# Altium schematic sheet CSI_connectors.SchDoc
size B
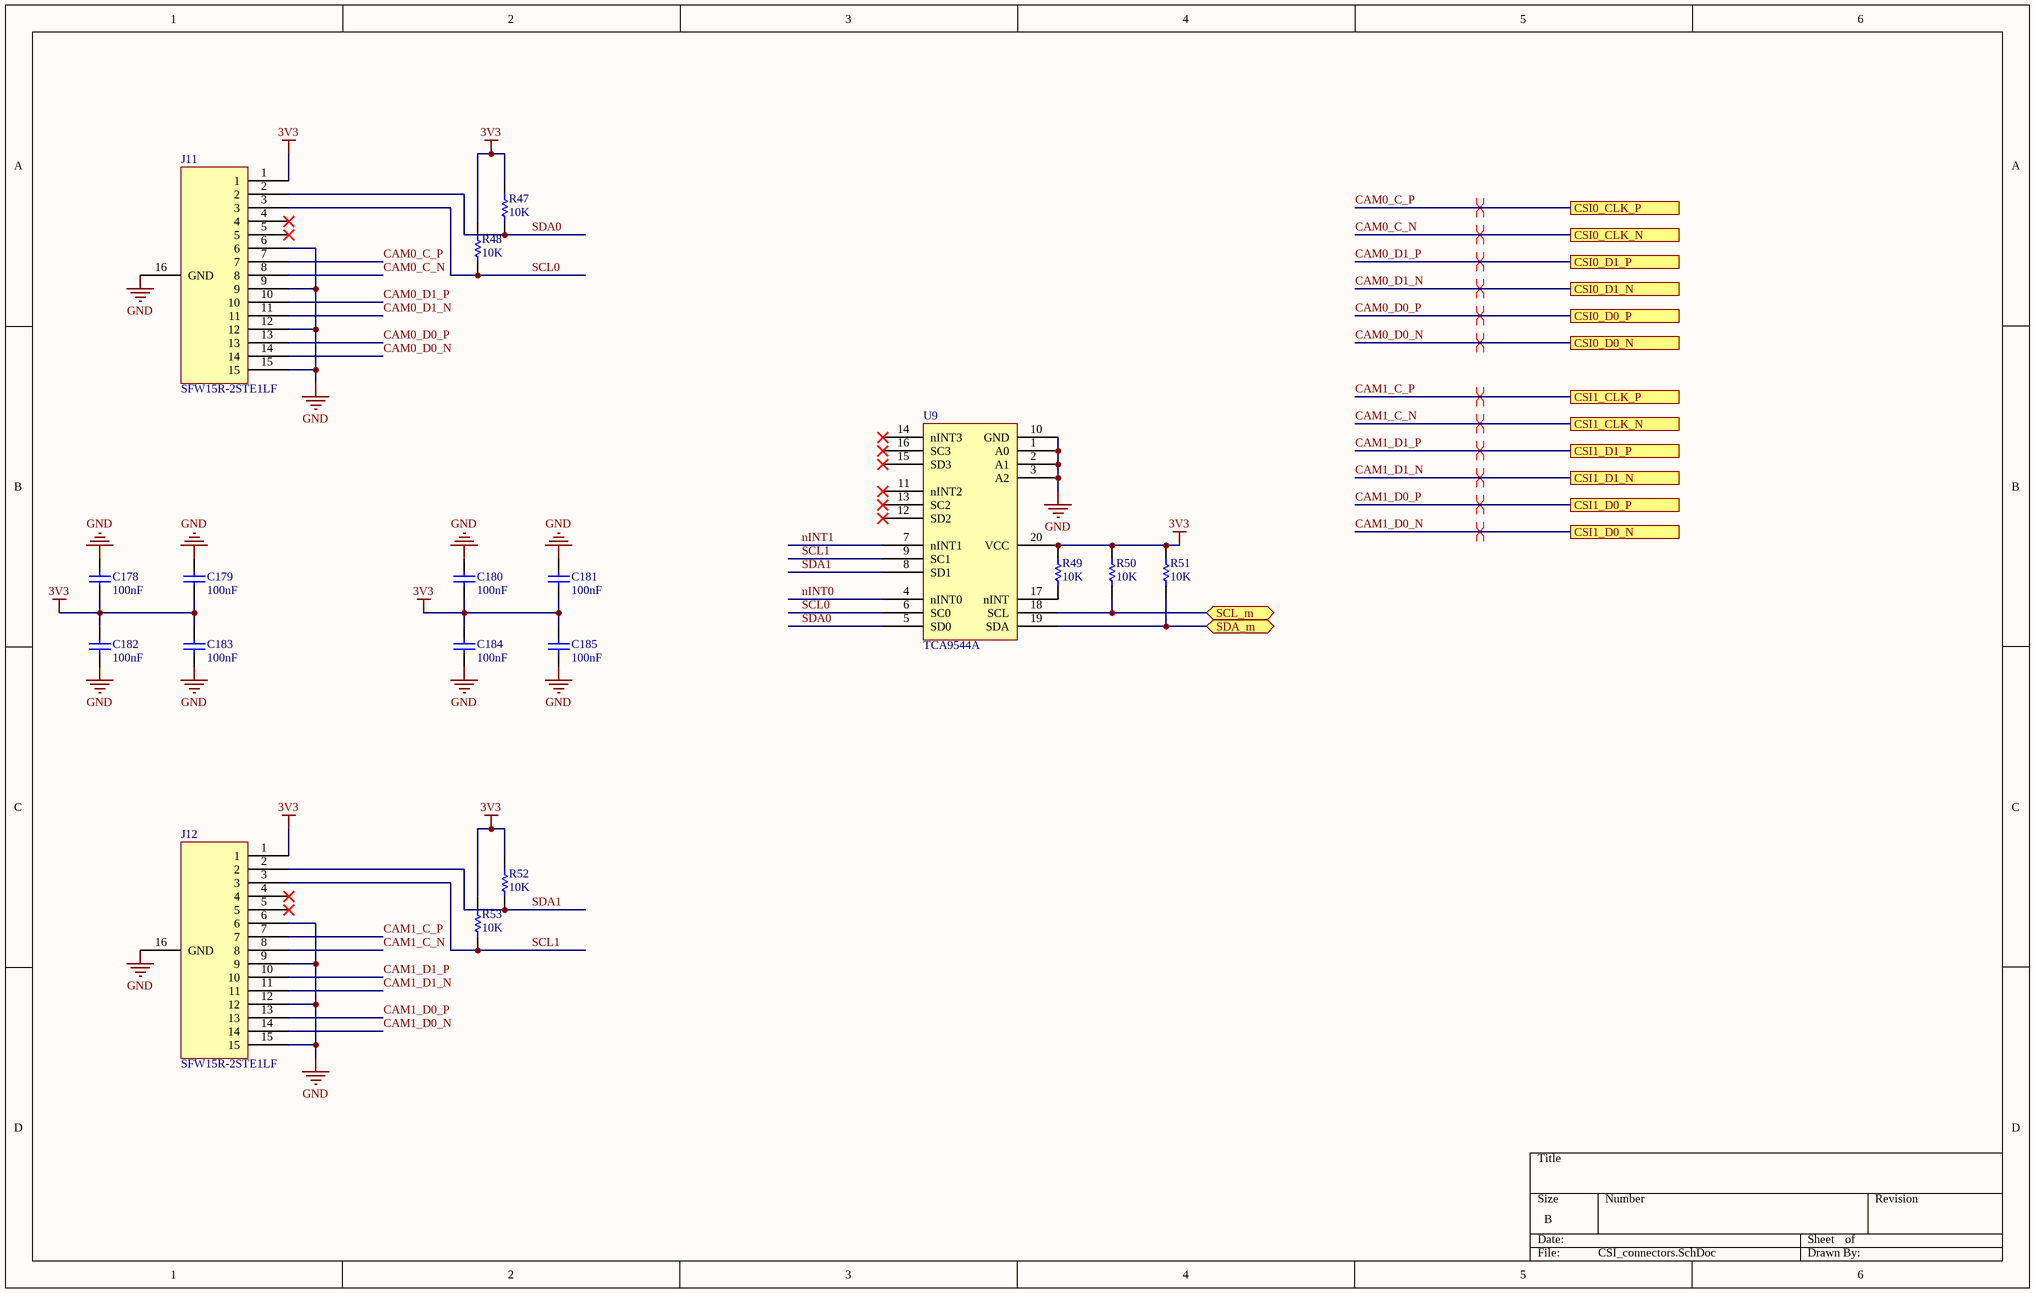
[diagram p0: CSI_connectors.SchDoc]

## Parts
C178  100nF  [CAPC0603(1608)100_N]
C179  100nF  [CAPC0603(1608)100_N]
C180  100nF  [CAPC0603(1608)100_N]
C181  100nF  [CAPC0603(1608)100_N]
C182  100nF  [CAPC0603(1608)100_N]
C183  100nF  [CAPC0603(1608)100_N]
C184  100nF  [CAPC0603(1608)100_N]
C185  100nF  [CAPC0603(1608)100_N]
J11  SFW15R-2STE1LF  [SFW15R-2STE1LF]
J12  SFW15R-2STE1LF  [SFW15R-2STE1LF]
R47  10K  [RESC0603(1608)_N]
R48  10K  [RESC0603(1608)_N]
R49  10K  [RESC0603(1608)_N]
R50  10K  [RESC0603(1608)_N]
R51  10K  [RESC0603(1608)_N]
R52  10K  [RESC0603(1608)_N]
R53  10K  [RESC0603(1608)_N]
U9  TCA9544A  [TSOP65P640X120-20N]

## Ports
CSI0_CLK_N, CSI0_CLK_P, CSI0_D0_N, CSI0_D0_P, CSI0_D1_N, CSI0_D1_P, CSI1_CLK_N, CSI1_CLK_P, CSI1_D0_N, CSI1_D0_P, CSI1_D1_N, CSI1_D1_P, SCL_m (bidir), SDA_m (bidir)

## Nets
3V3: C178.1 C179.1 C180.1 C181.1 C182.2 C183.2 C184.2 C185.2 J11.1 J12.1 R47.2 R48.2 R49.2 R50.2 R51.2 R52.2 R53.2 U9.20(VCC)
GND: C178.2 C179.2 C180.2 C181.2 C182.1 C183.1 C184.1 C185.1 J11.6 J11.9 J11.12 J11.15 J11.16(GND) J12.6 J12.9 J12.12 J12.15 J12.16(GND) U9.1(A0) U9.2(A1) U9.3(A2) U9.10(GND)
CAM0_C_N: J11.8 ; port CSI0_CLK_N
CAM0_C_P: J11.7 ; port CSI0_CLK_P
CAM0_D0_N: J11.14 ; port CSI0_D0_N
CAM0_D0_P: J11.13 ; port CSI0_D0_P
CAM0_D1_N: J11.11 ; port CSI0_D1_N
CAM0_D1_P: J11.10 ; port CSI0_D1_P
CAM1_C_N: J12.8 ; port CSI1_CLK_N
CAM1_C_P: J12.7 ; port CSI1_CLK_P
CAM1_D0_N: J12.14 ; port CSI1_D0_N
CAM1_D0_P: J12.13 ; port CSI1_D0_P
CAM1_D1_N: J12.11 ; port CSI1_D1_N
CAM1_D1_P: J12.10 ; port CSI1_D1_P
nINT0: U9.4(nINT0)
nINT1: U9.7(nINT1)
SCL0: J11.3 R48.1 U9.6(SC0)
SCL1: J12.3 R53.1 U9.9(SC1)
SCL_m: R50.1 U9.18(SCL) ; port SCL_m
SDA0: J11.2 R47.1 U9.5(SD0)
SDA1: J12.2 R52.1 U9.8(SD1)
SDA_m: R51.1 U9.19(SDA) ; port SDA_m
NetR49_1: R49.1 U9.17(nINT)

Not connected (* = marked no-connect by the designer): J11 4* 5*; J12 4* 5*; U9 11(nINT2)* 12(SD2)* 13(SC2)* 14(nINT3)* 15(SD3)* 16(SC3)*

## Layout directives
differential pair: CAM0_C_N, CAM0_C_P, CAM0_D0_N, CAM0_D0_P, CAM0_D1_N, CAM0_D1_P, CAM1_C_N, CAM1_C_P, CAM1_D0_N, CAM1_D0_P, CAM1_D1_N, CAM1_D1_P

## Library data of the parts
C178-C185 = CAP_0603: 100nF 10V; Value: 1uF; Rated Voltage: 50 V; Case-EIA: 0603; Case-Metric: 1608; Tolerance: Â±10%; Technology: SMT; Max Thickness: 1 mm
R47-R53 = CMP-1012-00623-1: 10K 0.1W 1% 0603 (1608 Metric)  SMD; Value: 10000.00 Ohm; Case-EIA: 0603; Case-Metric: 1608; Power: 0.1 W; Tolerance: 1 %; Technology: SMT
U9 = TCA9544A: Low Voltage 4-Channel I / 2C and SMBus Multiplexer With Interrupt Logic